# Altium schematic sheet sch_CPU.SchDoc
size A4
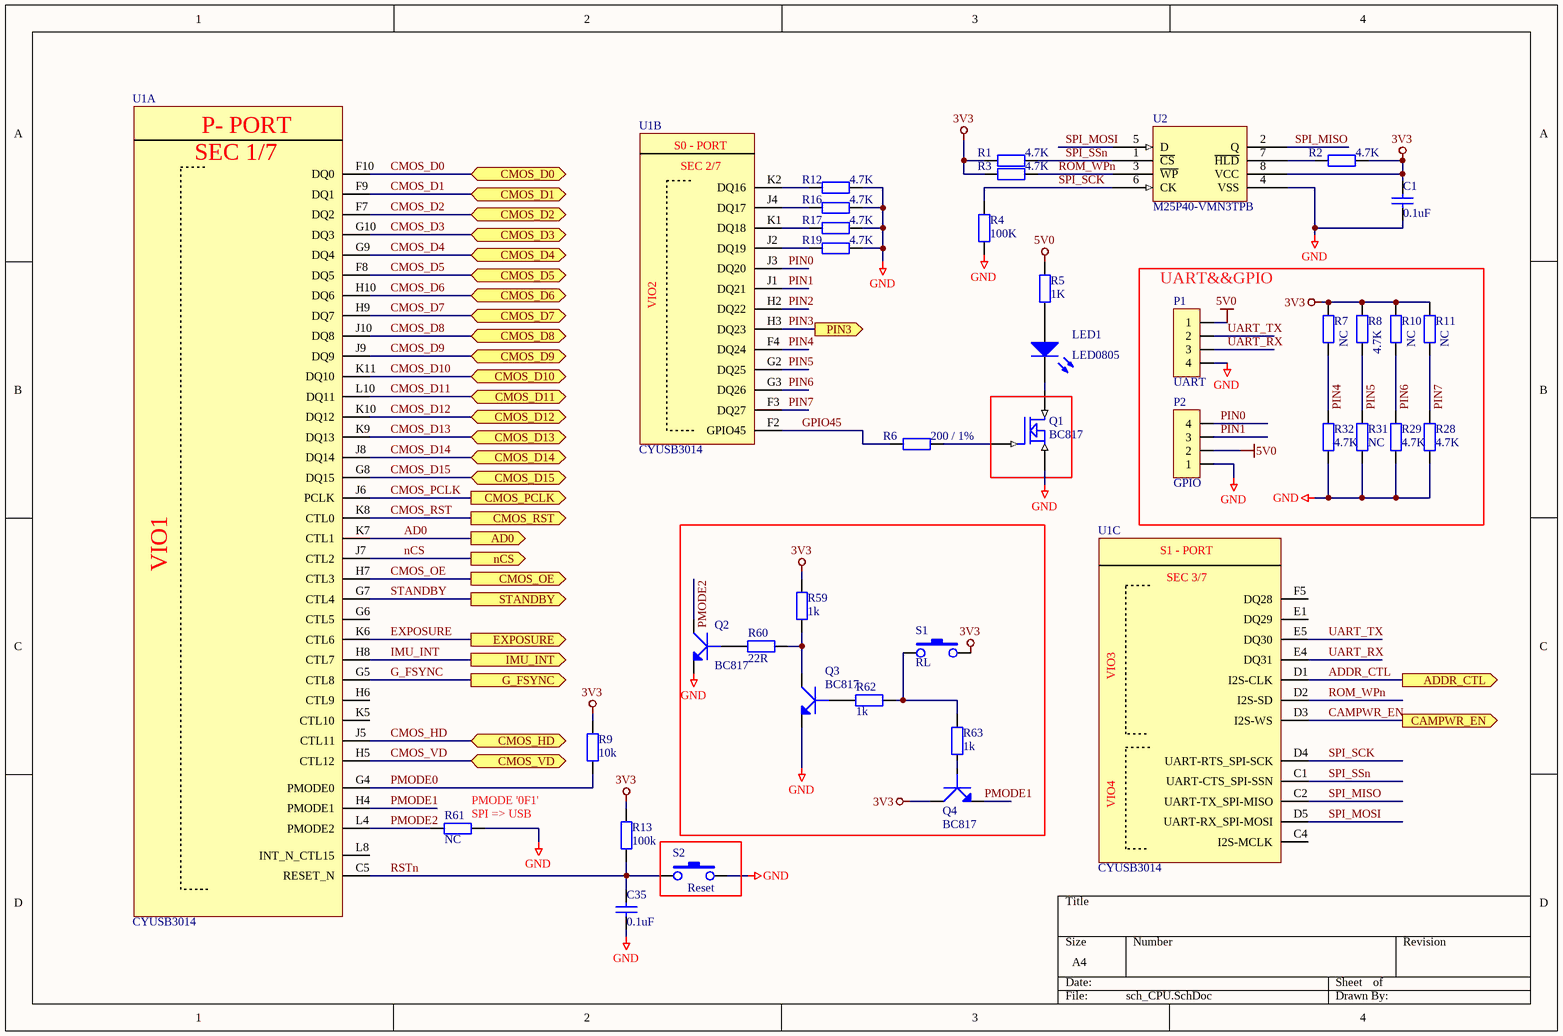
[diagram p0: sch_CPU.SchDoc]

## Parts
C1  0.1uF  [0402C]
C35  0.1uF  [0402C]
LED1  LED0805  [LED0805A_L210W100H60]
P1  UART  [WAFER4_P1.25L6.25W3.4H4.3]
P2  GPIO  [WAFER4_P1.25L6.25W3.4H4.3]
Q1  BC817  [SOT-23L]
Q2  BC817  [SOT-23L]
Q3  BC817  [SOT-23L]
Q4  BC817  [SOT-23L]
R1  4.7K  [0402R]
R2  4.7K  [0402R]
R3  4.7K  [0402R]
R4  100K  [0402R]
R5  1K  [0402R]
R6  value 200 / 1%  [0402R]  (hidden comment: 200R)
R7  NC  [0402R]
R8  4.7K  [0402R]
R9  10K  [0402R]
R10  NC  [0402R]
R11  NC  [0402R]
R12  4.7K  [0402R]
R13  100K  [0402R]
R16  4.7K  [0402R]
R17  4.7K  [0402R]
R19  4.7K  [0402R]
R28  4.7K  [0402R]
R29  4.7K  [0402R]
R31  value NC  [0402R]  (hidden comment: NC\)
R32  4.7K  [0402R]
R59  1K  [0402R]
R60  22R  [0402R]
R61  NC  [0805R]
R62  1k  [0402R]
R63  1k  [0402R]
S1  RL  [SW_L40W30H25_MPTFP]
S2  Reset  [SW_L40W30H25_MPTFP]
U1  CYUSB3014  [FBGA121_P80L100W100H11]  (parts A,B,C of 7)
U2  M25P40-VMN3TPB  [SO8N_P127L50W40W62H17]

## Blocks framed on the sheet
UART&&GPIO: P1 P2 R7 R8 R10 R11 R28 R29 R31 R32

## Ports
AD0 (out), ADDR_CTL (out), CAMPWR_EN (out), CMOS_D0 (bidir), CMOS_D1 (bidir), CMOS_D2 (bidir), CMOS_D3 (bidir), CMOS_D4 (bidir), CMOS_D5 (bidir), CMOS_D6 (bidir), CMOS_D7 (bidir), CMOS_D8 (bidir), CMOS_D9 (bidir), CMOS_D10 (bidir), CMOS_D11 (bidir), CMOS_D12 (bidir), CMOS_D13 (bidir), CMOS_D14 (bidir), CMOS_D15 (bidir), CMOS_HD (bidir), CMOS_OE (out), CMOS_PCLK (out), CMOS_RST (out), CMOS_VD (bidir), EXPOSURE (out), G_FSYNC (out), IMU_INT (out), nCS (out), PIN3 (out), STANDBY (out)

## Nets
3V3: C1.2 Q4.3(C) R1.1 R2.2 R3.1 R7.2 R8.2 R9.1 R10.2 R11.2 R13.1 R59.2 S1.1 U2.8(VCC)
5V0: P1.1 P2.2 R5.1
GND: C1.1 C35.1 P1.4 P2.1 Q1.2(S) Q2.2(E) Q3.2(E) R4.1 R12.2 R16.2 R17.2 R19.2 R28.2 R29.2 R31.2 R32.2 R61.1 S2.2 U2.4(VSS)
AD0: U1.K7(CTL1) ; port AD0
ADDR_CTL: U1.D1(I2S-CLK) ; port ADDR_CTL
CAMPWR_EN: U1.D3(I2S-WS) ; port CAMPWR_EN
CMOS_D0: U1.F10(DQ0) ; port CMOS_D0
CMOS_D1: U1.F9(DQ1) ; port CMOS_D1
CMOS_D2: U1.F7(DQ2) ; port CMOS_D2
CMOS_D3: U1.G10(DQ3) ; port CMOS_D3
CMOS_D4: U1.G9(DQ4) ; port CMOS_D4
CMOS_D5: U1.F8(DQ5) ; port CMOS_D5
CMOS_D6: U1.H10(DQ6) ; port CMOS_D6
CMOS_D7: U1.H9(DQ7) ; port CMOS_D7
CMOS_D8: U1.J10(DQ8) ; port CMOS_D8
CMOS_D9: U1.J9(DQ9) ; port CMOS_D9
CMOS_D10: U1.K11(DQ10) ; port CMOS_D10
CMOS_D11: U1.L10(DQ11) ; port CMOS_D11
CMOS_D12: U1.K10(DQ12) ; port CMOS_D12
CMOS_D13: U1.K9(DQ13) ; port CMOS_D13
CMOS_D14: U1.J8(DQ14) ; port CMOS_D14
CMOS_D15: U1.G8(DQ15) ; port CMOS_D15
CMOS_HD: U1.J5(CTL11) ; port CMOS_HD
CMOS_OE: U1.H7(CTL3) ; port CMOS_OE
CMOS_PCLK: U1.J6(PCLK) ; port CMOS_PCLK
CMOS_RST: U1.K8(CTL0) ; port CMOS_RST
CMOS_VD: U1.H5(CTL12) ; port CMOS_VD
EXPOSURE: U1.K6(CTL6) ; port EXPOSURE
G_FSYNC: U1.G5(CTL8) ; port G_FSYNC
GPIO45: R6.1 U1.F2(GPIO45)
IMU_INT: U1.H8(CTL7) ; port IMU_INT
nCS: U1.J7(CTL2) ; port nCS
PIN0: P2.4 U1.J3(DQ20)
PIN1: P2.3 U1.J1(DQ21)
PIN2: U1.H2(DQ22)
PIN3: U1.H3(DQ23) ; port PIN3
PIN4: R7.1 R32.1 U1.F4(DQ24)
PIN5: R8.1 R31.1 U1.G2(DQ25)
PIN6: R10.1 R29.1 U1.G3(DQ26)
PIN7: R11.1 R28.1 U1.F3(DQ27)
PMODE0: R9.2 U1.G4(PMODE0)
PMODE1: Q4.2(E) U1.H4(PMODE1)
PMODE2: Q2.3(C) R61.2 U1.L4(PMODE2)
ROM_WPn: R3.2 U1.D2(I2S-SD) U2.3(~{WP})
RSTn: C35.2 R13.2 S2.1 U1.C5(RESET_N)
SPI_MISO: U1.C2(UART-TX_SPI-MISO) U2.2(Q)
SPI_MOSI: U1.D5(UART-RX_SPI-MOSI) U2.5(D)
SPI_SCK: R4.2 U1.D4(UART-RTS_SPI-SCK) U2.6(CK)
SPI_SSn: R1.2 U1.C1(UART-CTS_SPI-SSN) U2.1(~{CS})
STANDBY: U1.G7(CTL4) ; port STANDBY
UART_RX: P1.3 U1.E4(DQ31)
UART_TX: P1.2 U1.E5(DQ30)
NetLED1_1: LED1.1(A) R5.2
NetLED1_2: LED1.2(K) Q1.3(D)
NetQ1_1: Q1.1(G) R6.2
NetQ2_1: Q2.1(B) R60.1
NetQ3_1: Q3.1(B) R62.2
NetQ3_3: Q3.3(C) R59.1 R60.2
NetQ4_1: Q4.1(B) R63.2
NetR2_1: R2.1 U2.7(~{HLD})
NetR12_1: R12.1 U1.K2(DQ16)
NetR16_1: R16.1 U1.J4(DQ17)
NetR17_1: R17.1 U1.K1(DQ18)
NetR19_1: R19.1 U1.J2(DQ19)
NetR62_1: R62.1 R63.1 S1.2

Not connected (* = marked no-connect by the designer): U1 C4(I2S-MCLK) E1(DQ29) F5(DQ28) G6(CTL5) H6(CTL9) K5(CTL10) L8(INT_N_CTL15)

## Notes on the sheet
- (near R61) PMODE '0F1'
- (near R61) SPI => USB
- (in symbol CYUSB3014, part A) P- PORT; SEC 1/7; VIO1
- (in symbol CYUSB3014, part B) S0 - PORT; SEC 2/7
- (in symbol CYUSB3014, part C) S1 - PORT; SEC 3/7

## Library data of the parts
C1 C35 = Cap: Capacitor; Published: 8-Jun-2000; LatestRevisionDate: 17-Jul-2002; LatestRevisionNote: Re-released for DXP Platform.; PackageReference: RAD-0.3; Publisher: Altium Limited; Value: 0.1uF
LED1 = LED: 发光二级管
P1 P2 = CON4
Q1 = MOSFET N
Q2-Q4 = NPN: NPN Transistor
R1-R13 R16 R17 R19 R28 R29 R31 R32 R59 R61-R63 = Resistor: Published: 8-Jun-2000; LatestRevisionDate: 17-Jul-2002; LatestRevisionNote: Re-released for DXP Platform.; PackageReference: AXIAL-0.4; Publisher: Altium Limited
  R1-R3 R8 R12 R16 R17 R19 R28 R29 R32: Value: 4.7K
  R4: Value: 100K
  R5: Value: 1K
  R7 R10 R11 R61: Value: NC
  R9: Value: 10k
  R13: Value: 100k
  R59 R62 R63: Value: 1k
R60 = Resistor: Value: 10k; Published: 8-Jun-2000; LatestRevisionDate: 17-Jul-2002; LatestRevisionNote: Re-released for DXP Platform.; PackageReference: AXIAL-0.4; Publisher: Altium Limited
S1 S2 = Button_sop: Value: BUTTON